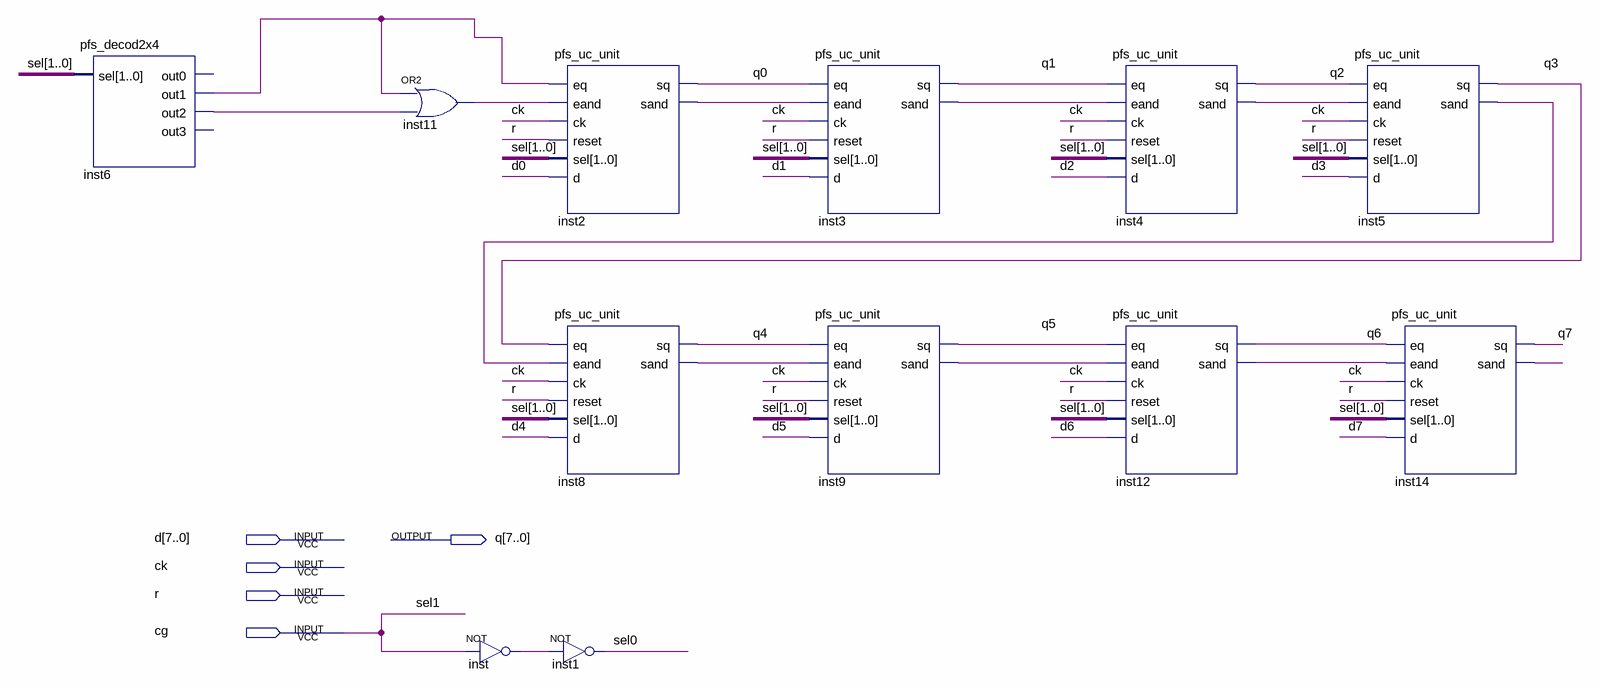
[diagram p0: schematic sheet]
// Quartus schematic pfs_accumulator.bdf as structural Verilog: 12 symbols, 5 pins
module pfs_accumulator (
  input  [7:0] d,
  input  ck,
  input  r,
  input  cg,
  output [7:0] q
);

  wire inst2_sand, inst3_sand, inst4_sand, inst5_sand, inst6_out1, inst6_out2, inst8_sand, inst9_sand,
       inst11_out, inst12_sand, inst14_sand, inst_out;
  wire [0:0] sel;

  pfs_decod2x4 inst6 (.sel({cg, sel[0]}), .out1(inst6_out1), .out2(inst6_out2));  // open: out0, out3
  or inst11 (inst11_out, inst6_out1, inst6_out2);
  not inst (inst_out, cg);
  pfs_uc_unit inst2 (
    .eq(inst6_out1), .eand(inst11_out), .ck(ck), .reset(r), .sel({cg, sel[0]}), .d(d[0]), .sq(q[0]),
    .sand(inst2_sand));
  pfs_uc_unit inst8 (
    .eq(q[3]), .eand(inst5_sand), .ck(ck), .reset(r), .sel({cg, sel[0]}), .d(d[4]), .sq(q[4]),
    .sand(inst8_sand));
  not inst1 (sel[0], inst_out);
  pfs_uc_unit inst3 (
    .eq(q[0]), .eand(inst2_sand), .ck(ck), .reset(r), .sel({cg, sel[0]}), .d(d[1]), .sq(q[1]),
    .sand(inst3_sand));
  pfs_uc_unit inst9 (
    .eq(q[4]), .eand(inst8_sand), .ck(ck), .reset(r), .sel({cg, sel[0]}), .d(d[5]), .sq(q[5]),
    .sand(inst9_sand));
  pfs_uc_unit inst4 (
    .eq(q[1]), .eand(inst3_sand), .ck(ck), .reset(r), .sel({cg, sel[0]}), .d(d[2]), .sq(q[2]),
    .sand(inst4_sand));
  pfs_uc_unit inst12 (
    .eq(q[5]), .eand(inst9_sand), .ck(ck), .reset(r), .sel({cg, sel[0]}), .d(d[6]), .sq(q[6]),
    .sand(inst12_sand));
  pfs_uc_unit inst5 (
    .eq(q[2]), .eand(inst4_sand), .ck(ck), .reset(r), .sel({cg, sel[0]}), .d(d[3]), .sq(q[3]),
    .sand(inst5_sand));
  pfs_uc_unit inst14 (
    .eq(q[6]), .eand(inst12_sand), .ck(ck), .reset(r), .sel({cg, sel[0]}), .d(d[7]), .sq(q[7]),
    .sand(inst14_sand));

  // Other names for the same wires on the sheet: sel[1] = cg; sel1 = cg
endmodule
